# EAGLE design chain (EAGLE 6.5.0)
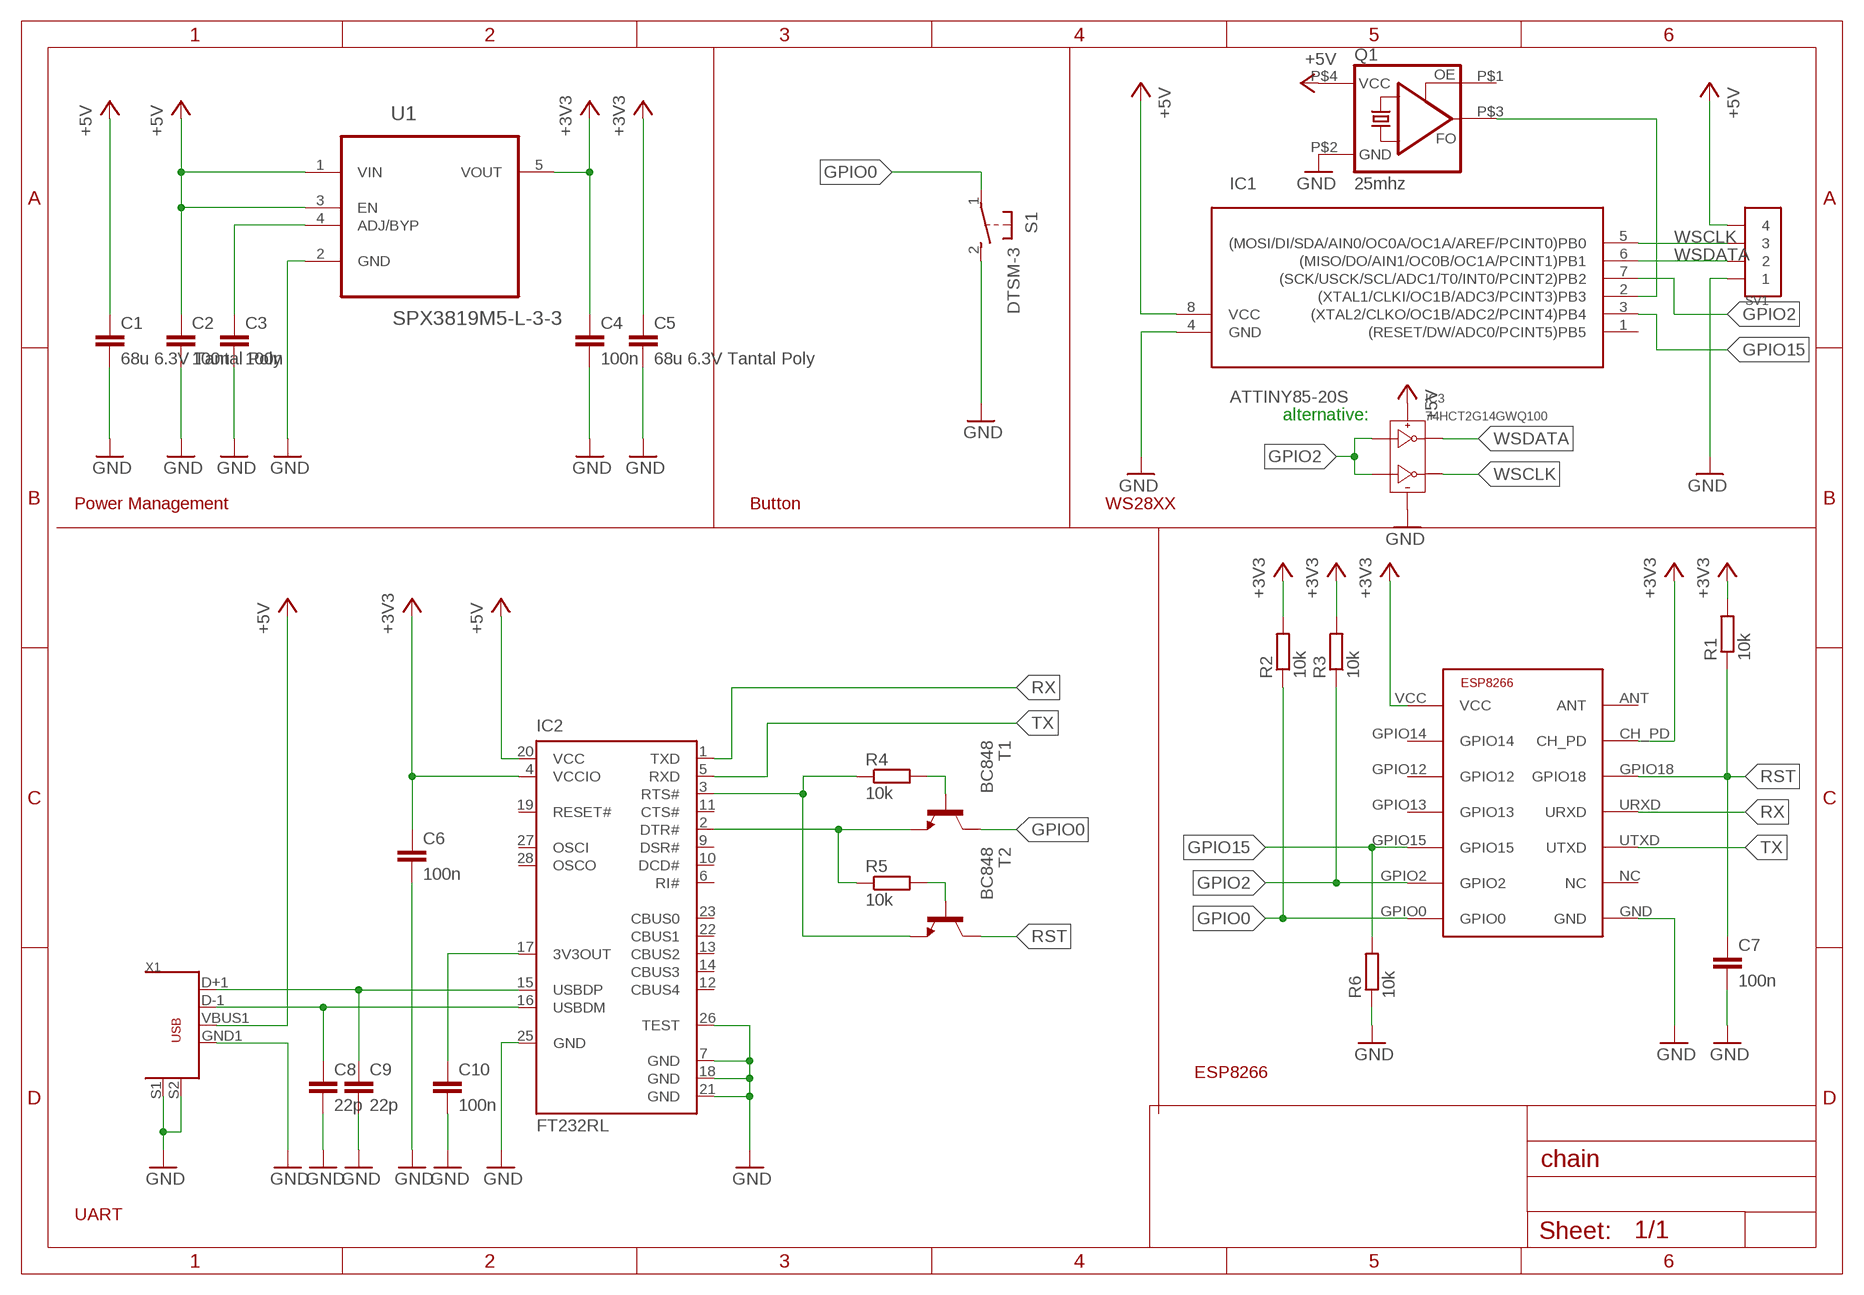
[diagram p0: schematic, sheet 1]

## Parts
C1  68u 6.3V Tantal Poly  C-EUC0805  [C0805]
C2  100n  C-EUC0603  [C0603]
C3  100n  C-EUC0603  [C0603]
C4  100n  C-EUC0603  [C0603]
C5  68u 6.3V Tantal Poly  C-EUC0805  [C0805]
C6  100n  C-EUC0603  [C0603]
C7  100n  C-EUC0603  [C0603]
C8  22p  C-EUC0603  [C0603]
C9  22p  C-EUC0603  [C0603]
C10  100n  C-EUC0603  [C0603]
IC1  ATTINY85-20S  [SOIC8]
IC2  FT232RL  [SSOP28]
IC3  74HCT2G14GWQ100  74HCT2G14  [SOT363]
Q1  25mhz  KC5032A  [KC5032A]
R1  10k  R-EU_R0603  [R0603]
R2  10k  R-EU_R0603  [R0603]
R3  10k  R-EU_R0603  [R0603]
R4  10k  R-EU_R0603  [R0603]
R5  10k  R-EU_R0603  [R0603]
R6  10k  R-EU_R0603  [R0603]
S1  DTSM-3  [DTSM-3]
SV1  1X4SMD-2.54LIEGEND  [1X4SMD-2.54LIEGEND]
T1  BC848  [SOT23]
T2  BC848  [SOT23]
U1  SPX3819M5-L-3-3  [SOT95P280X145-5N]
U$2  ESP8266  [ESP-03]
X1  USB-MALE-SMT  [USB-MALE-SMT]

## Nets
+3V3: C4.1 C5.1 C6.1 IC2.4(VCCIO) R1.2 R2.2 R3.2 U1.5(VOUT) U$2.CH_PD U$2.VCC
+5V [pwr]: C1.1 C2.1 IC1.8(VCC) IC2.20(VCC) IC3.5(VCC) Q1.P$4(VCC) SV1.P$4 U1.1(VIN) U1.3(EN) X1.VBUS1(VBUS)
GND [pwr]: C1.2 C2.2 C3.2 C4.2 C5.2 C6.2 C7.2 C8.2 C9.2 C10.2 IC1.4(GND) IC2.7(GND) IC2.18(GND) IC2.21(GND) IC2.25(GND) IC2.26(TEST) IC3.2(GND) Q1.P$2(GND) R6.1 S1.2 SV1.P$1 U1.2(GND) U$2.GND X1.GND1(GND) X1.S1 X1.S2
GPIO0: R2.1 S1.1 T1.3(C) U$2.GPIO0
GPIO2: IC1.7((SCK/USCK/SCL/ADC1/T0/INT0/PCINT2)PB2) IC3.1(1A) IC3.3(2A) R3.1 U$2.GPIO2
GPIO15: IC1.3((XTAL2/CLKO/OC1B/ADC2/PCINT4)PB4) R6.2 U$2.GPIO15
N$1: IC2.3(RTS#) R4.1 T2.2(E)
N$2: IC1.2((XTAL1/CLKI/OC1B/ADC3/PCINT3)PB3) Q1.P$3(FO)
N$3: C9.1 IC2.15(USBDP) X1.D+1(D+)
N$4: C8.1 IC2.16(USBDM) X1.D-1(D-)
N$5: IC2.2(DTR#) R5.1 T1.2(E)
N$7: R4.2 T1.1(B)
N$8: R5.2 T2.1(B)
N$15: C10.1 IC2.17(3V3OUT)
N$17: C3.1 U1.4(ADJ/BYP)
RST: C7.1 R1.1 T2.3(C) U$2.GPIO18
RX: IC2.1(TXD) U$2.URXD
TX: IC2.5(RXD) U$2.UTXD
WSCLK: IC1.5((MOSI/DI/SDA/AIN0/OC0A/OC1A/AREF/PCINT0)PB0) IC3.4(2Y) SV1.P$3
WSDATA: IC1.6((MISO/DO/AIN1/OC0B/OC1A/PCINT1)PB1) IC3.6(1Y) SV1.P$2
Unconnected: IC1.1((RESET/DW/ADC0/PCINT5)PB5) IC2.6(RI#) IC2.9(DSR#) IC2.10(DCD#) IC2.11(CTS#) IC2.12(CBUS4) IC2.13(CBUS2) IC2.14(CBUS3) IC2.19(RESET#) IC2.22(CBUS1) IC2.23(CBUS0) IC2.27(OSCI) IC2.28(OSCO) Q1.P$1(OE) U$2.ANT U$2.GPIO12 U$2.GPIO13 U$2.GPIO14 U$2.NC

## Notes on the sheet
- alternative:
- Power Management | Button | WS28XX
- ESP8266
- UART

## Library data of the parts
C1 C5 = rcl-2:C-EU: CAPACITOR, European symbol
C2-C4 C6-C10 = rcl:C-EU: CAPACITOR, European symbol
IC1 = avr:ATTINY85: MICROCONTROLLER 8 Kbytes FLASH 512 bytes EEPROM 512 bytes RAM 4-channel 10 bit ADC USI
IC2 = ftdichip:FT232R: Source: http://www.ftdichip.com/Documents/DataSheets/DS_FT232R_v104.pdf
IC3 = sid:74HCT2G14
Q1 = sid:KC5032A
R1-R6 = rcl-2:R-EU_: RESISTOR, European symbol
S1 = switch-tact:DTSM-3
SV1 = sid:1X4SMD-2.54LIEGEND
T1 T2 = transistor-neu-to92:BC848: NPN TRANSISTOR
U1 = ESP8266-2:SPX3819M5-L-3-3: 500mA, LOW-NOISE LDO VOLTAGE REGULATOR; MPN: SPX3819M5-L-3-3; OC_FARNELL: 1831949; OC_NEWARK: 23R9702; PACKAGE: SOT-23-5; SUPPLIER: EXAR
U$2 = ESP8266:ESP8266: low cost Wifi to Serial Module
X1 = sid:USB-MALE-SMT

## Net classes
0 default: width 0.152 mm, drill 0.305 mm, clearance 0.152 mm
1 pwr: width 0.152 mm, drill 0.305 mm, clearance 0.152 mm

## Board
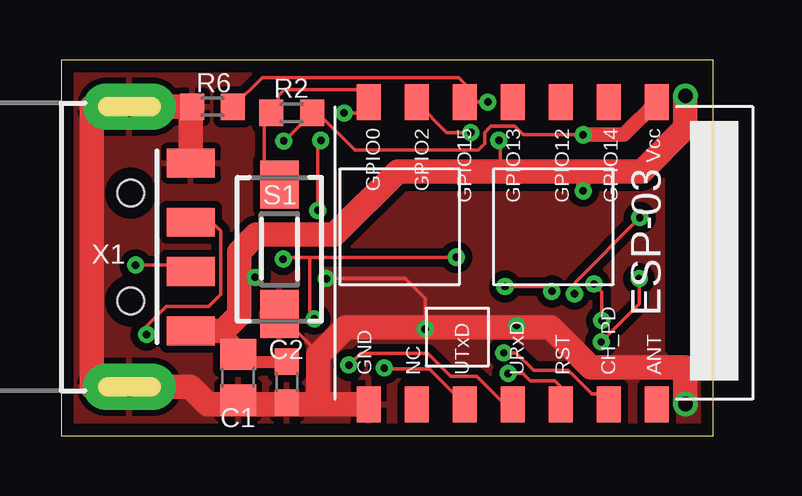
[diagram p1: board, top side]
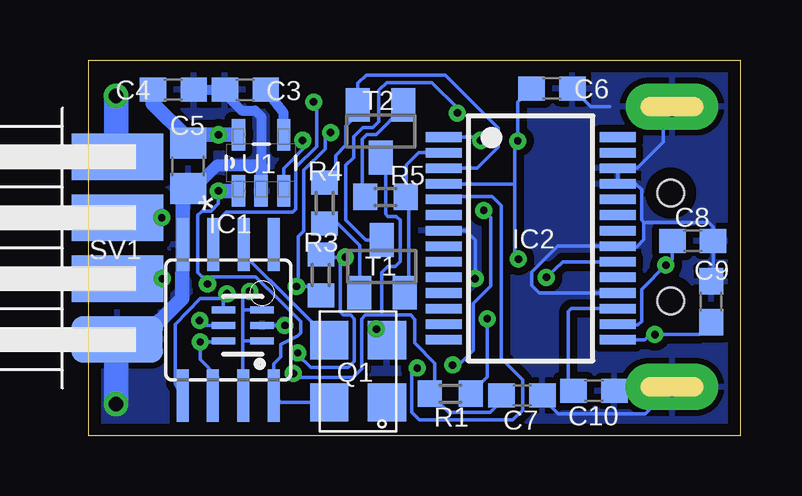
[diagram p2: board, bottom side, seen from below]

Size 27.16 x 15.67 mm. Coordinates in mm from the lower left corner, seen from the top.
Outline: 0,0 27.16,0 27.16,15.67 0,15.67 0,0
Copper layers (1*16): Top 0.035mm / dielectric 1.5mm / Bottom 0.035mm
Design rules "default *": minimum track width 6mil, minimum drill 12mil, track to track 6mil, track to pad 6mil, pad to pad 6mil, via to via 6mil, smd to smd 6mil, copper to edge 20mil, drill to drill 8mil, minimum pad ring 10mil, minimum via ring 8mil, stop-mask expansion 4mil, vias tented up to drill 26mil, thermal gap 10mil
tRestrict: area 25.6,3.7 to 26.6,12.1

### Footprints (pad centres in the part's own frame; a part is rotated, then mirrored left to right if it is on the bottom)
C0805 = smd 1.3 x 1.5: 1 -0.95,0; 2 0.95,0
C0603 = smd 1.1 x 1: 1 -0.85,0; 2 0.85,0
SOIC8 = smd 0.5 x 2.2: 1 -1.905,-3.154; 2 -0.645,-3.154; 3 0.625,-3.154; 4 1.895,-3.154; 5 1.905,3.154; 6 0.635,3.154; 7 -0.635,3.154; 8 -1.905,3.154
SSOP28 = smd 0.4 x 1.5: 1 -4.225,-3.625; 2 -3.575,-3.625; 3 -2.925,-3.625; 4 -2.275,-3.625; 5 -1.625,-3.625; 6 -0.975,-3.625; 7 -0.325,-3.625; 8 0.325,-3.625; 9 0.975,-3.625; 10 1.625,-3.625; 11 2.275,-3.625; 12 2.925,-3.625; 13 3.575,-3.625; 14 4.225,-3.625; 15 4.225,3.625; 16 3.575,3.625; 17 2.925,3.625; 18 2.275,3.625; 19 1.625,3.625; 20 0.975,3.625; 21 0.325,3.625; 22 -0.325,3.625; 23 -0.975,3.625; 24 -1.625,3.625; 25 -2.275,3.625; 26 -2.925,3.625; 27 -3.575,3.625; 28 -4.225,3.625
SOT363 = smd 0.3 x 0.99: 1 -0.65,-0.8; 2 0,-0.8; 3 0.65,-0.8; 4 0.65,0.81; 5 0,0.81; 6 -0.65,0.81
KC5032A = smd 1.6 x 1.6: P$1 -1.3,-1.2; P$2 1.3,-1.2; P$3 1.3,1.2; P$4 -1.3,1.2
R0603 = smd 1 x 1.1: 1 -0.85,0; 2 0.85,0
DTSM-3 = smd 2 x 1.6: 1 -2.7,0; 2 2.7,0
1X4SMD-2.54LIEGEND = smd 1.93 x 3.81: P$1 -5.08,0; P$2 -2.54,0; P$3 0,0; P$4 2.54,0
SOT23 = smd 1 x 1.4: 1 -0.95,-1.1; 2 0.95,-1.1; 3 0,1.1
SOT95P280X145-5N = smd 1.321 x 0.559: 1 -1.168,0.94; 2 -1.168,0; 3 -1.168,-0.94; 4 1.168,-0.94; 5 1.168,0.94
ESP-03 = smd 1 x 1.5: ANT 4,12.4; CH_PD 6,12.4; GND 16,12.4; GPIO0 16,-0.2; GPIO2 14,-0.2; GPIO12 8,-0.2; GPIO13 10,-0.2; GPIO14 6,-0.2; GPIO15 12,-0.2; GPIO18 8,12.4; NC 14,12.4; URXD 10,12.4; UTXD 12,12.4; VCC 4,-0.2
USB-MALE-SMT = smd 1.2 x 2: D+1 1.027,-6.21; D-1 -1.027,-6.21; GND1 3.5,-6.21; VBUS1 -3.5,-6.21 | drill 0.813 pad 1.93 long: S1 -5.842,-3.658; S2 5.842,-3.658 | hole 1.1: 2.25,-3.71; -2.25,-3.71

### Placement (x,y rotation side)
C1  7.37,2.44 270 top
C2  9.4,2.24 270 top
C3  20.62,14.43 180 bottom
C4  23.62,14.43 0 bottom
C5  23.01,11.25 270 bottom
C6  7.85,14.48 0 bottom
C7  9.09,1.68 0 bottom
C8  1.98,8.13 0 bottom
C9  1.22,5.59 90 bottom
C10  6.1,1.88 0 bottom
IC1  21.34,4.83 180 bottom
IC2  8.74,8.23 270 bottom
IC3  20.73,4.6 90 bottom
Q1  15.93,2.69 90 bottom
R1  12.09,1.75 0 bottom
R2  9.6,13.46 0 top
R3  17.48,6.71 90 bottom
R4  17.32,9.7 270 bottom
R5  14.78,9.96 180 bottom
R6  6.3,13.72 0 top
S1  9.09,7.77 270 top
SV1  25.96,9.09 90 bottom
T1  14.94,7.06 0 bottom
T2  14.99,12.7 180 bottom
U1  19.96,11.38 90 bottom
U$2  28.8,13.72 180 top
X1  -0.81,7.87 90 top

### Tracks (layer width: path | path; a pad name or v marks a point on that pad's centre or on a via)
+3V3  (via drill 0.3, 0.3 pad 0.3)
  Top 0.152: v21.74,12.55 19.25,12.55 18.9,12.9 17.91,12.9 17.65,12.65 17.65,12.19 17.37,11.91 12.25,11.91 10.69,13.46 R2.2 9.41,12.42 v9.27,12.29 | v16.46,7.44 10.36,7.44 | 10.36,7.44 9.32,7.44 v9.25,7.37 | v18.44,3.45 18.95,3.45 19.68,2.72 21.13,2.72 22.1,1.75 22.39,1.75 U$2.CH_PD | v10.54,4.88 10.36,5.05 10.36,7.44
  Top 0.61: U$2.VCC 23.44,12.55 v21.74,12.55
  Bottom 0.152: R3.2 17.36,7.44 v16.46,7.44 16.66,7.24 16.66,5.16 16.54,5.03 16.23,5.03 16.08,4.88 16.08,3.1 16.33,2.84 17.91,2.84 18.44,3.38 v18.44,3.45 | v9.25,7.37 9.4,7.52 9.4,10.49 | R1.2 10.54,2.45 v10.54,4.88 | 9.4,10.49 9.4,12.17 v9.27,12.29 9.27,13.91 C6.1 | IC2.4 9.41,10.51 9.4,10.49
  Bottom 0.61: U1.5 v21.74,12.55 22.54,12.55 C5.1 23.06,12.45 24.47,13.85 C4.1
+5V  (via drill 0.3, 0.61)
  Top 0.152: v18.24,12.32 18.29,12.32 18.29,11.02 | v8.08,6.6 7.42,6.6 | v22.2,6.33 22.53,5.99 v22.53,4.8
  Top 0.508: 21.74,10.97 21.79,11.02 | 6.76,4.37 7.37,3.77 C1.1 7.67,3.09 C2.1
  Top 0.61: v21.74,10.21 21.74,10.97
  Top 1.016: X1.VBUS1 6.76,4.37 7.42,5.03 7.42,6.6 7.42,7.67 8.13,8.38 11.38,8.38 14.02,11.02 18.29,11.02 21.79,11.02 24.18,11.02 26.01,12.85 v26.01,14.17
  Bottom 0.152: IC2.20 7.41,7.26 v8.08,6.6 | Q1.P$4 19.15,1.39 IC1.8 19.43,3 19.15,3.28 19.15,3.81 18.44,4.17 18.31,4.29 18.31,4.77 19.68,6.15 19.71,6.15 20.19,6.63 22.28,6.63 | U1.3 19.02,11.15 18.16,12.01 18.16,12.32 v18.24,12.32 | v21.74,10.21 21.74,9.68 22.05,9.37 22.43,9.37 22.61,9.2 22.61,6.81 22.43,6.63 22.28,6.63 | 22.28,6.63 22.2,6.58 v22.2,6.33 | v22.53,4.8 22.33,4.6 IC3.5
  Bottom 0.61: U1.1 v21.74,10.21
  Bottom 1.016: v26.01,14.17 26.01,11.63 SV1.P$4
GND  (via drill 0.3, 0.3 pad 0.3, 0.61)
  Top 0.152: C1.2 7.37,1.32 | C2.2 9.6,1.32 | 10.46,1.32 10.62,1.47 10.16,1.47 | R6.1 5.4,13.72 | 9.09,5.28 S1.2 10.72,3.45 10.72,3.38 | 20.4,4.52 19.13,4.6 v18.97,4.6 | 11.86,4.52 11.94,4.45 v15.16,4.45 15.16,5.71 14.33,6.55 v11.05,6.55
  Top 1.016: X1.GND1 5.4,13.72 X1.S2 1.27,13.72 1.27,2.03 X1.S1 5.38,2.03 6.1,1.32 7.37,1.32 9.6,1.32 10.46,1.32 U$2.GND | v26.01,1.32 26.01,2.84 22.07,2.84 20.4,4.52 11.86,4.52 10.72,3.38 10.72,1.57 10.62,1.47
  Bottom 0.152: 4.01,8.89 1.32,8.89 1.13,8.7 C8.2 1.13,6.53 C9.2 | 4.01,8.89 4.01,8.18 4.32,7.87 4.94,7.87 IC2.21 7.61,7.91 8.69,6.83 8.69,6.27 8.37,5.95 IC2.18 | 4.01,8.89 4.11,8.99 4.11,10.26 4.36,10.51 IC2.25 IC2.26 4.29,11.16 3.2,12.24 3.2,13.36 X1.S2 | C10.2 2.84,1.88 X1.S1 3.96,0.91 7.58,0.91 8.24,1.58 C7.2 | IC2.7 11.45,8.55 11.05,8.15 v11.05,6.55 | IC3.2 v18.97,4.6 | Q1.P$2 15.16,4.43 v15.16,4.45 | C6.2 6.24,13.72 5.44,13.72
  Bottom 0.406: 19.96,11.28 19.96,13.31 20.22,13.56 20.78,13.56 21.47,14.26 C3.2 C4.2
  Bottom 0.508: C5.2 22.9,10.17 21.79,11.28 19.96,11.28 U1.2
  Bottom 0.61: C5.2 23.03,10.14 23.24,9.93 23.24,9.8 IC1.4 23.26,5.73 24.99,3.99 24.99,3.96 25.91,3.96 SV1.P$1
  Bottom 1.016: SV1.P$1 26.01,2.95 v26.01,1.32
  pour Top (isolate 0.305): 0.25,15.19 26.87,15.19 26.87,0.36 0.25,0.36
  pour Bottom (isolate 0.305): 0.25,15.39 26.87,15.39 26.87,0.36 0.25,0.36
GPIO0  (via drill 0.3)
  Top 0.152: v11.79,13.46 12.35,13.46 U$2.GPIO0 12.29,14.43 9.3,14.43 9.04,14.17 9.04,13.6 R2.1 8.75,13.32 8.46,13.03 8.46,11.11 S1.1
  Bottom 0.152: T1.3 15.6,8.16 16.43,8.99 16.43,11.28 16.1,11.61 16.1,12.47 15.72,12.85 15.32,12.85 15.06,13.11 15.06,14.4 14.73,14.73 12.85,14.73 11.76,13.64 11.76,13.49 v11.79,13.46
GPIO2  (via drill 0.3)
  Top 0.152: U$2.GPIO2 16.07,12.65 v17.07,12.65 | v20.45,6.02 20.24,6.22 v18.49,6.22
  Bottom 0.152: v17.07,12.65 17.3,12.42 17.3,11.96 18.19,11.07 18.19,8.53 18.41,8.31 18.41,6.3 v18.49,6.22 17.84,6.22 R3.1 | IC1.7 20.73,1.9 20.73,3.94 | 20.73,3.94 20.73,5.23 | 20.73,5.23 20.73,5.74 v20.45,6.02 | IC3.3 20.71,5.25 20.73,5.23 | IC3.1 20.72,3.95 20.73,3.94
GPIO15  (via drill 0.3)
  Top 0.152: R6.2 8.37,14.94 16.56,14.94 16.8,14.69 U$2.GPIO15 v17.78,13.92
  Bottom 0.152: IC1.3 21.76,8.98 21.41,9.32 18.64,9.32 18.52,9.45 18.52,11.2 17.65,12.06 17.65,13.77 v17.78,13.92
N$1
  Bottom 0.152: R4.1 17.32,10.54 16.87,11 16.87,11.68 16.43,12.12 16.43,12.9 15.96,13.38 T2.2 15.94,14.7 15.6,15.04 12.29,15.04 10.08,12.83 10.08,12.04 10.97,11.16 IC2.3
N$2
  Bottom 0.152: Q1.P$3 17.81,3.99 17.81,4.7 19.58,6.48 19.61,6.48 20.69,7.56 IC1.2
N$3  (via drill 0.3)
  Top 0.152: X1.D+1 6.29,8.9 6.65,8.53 6.65,5.89 6.15,5.38 4.37,5.38 3.56,4.57 v3.56,4.22
  Bottom 0.152: C9.1 1.74,4.22 v3.56,4.22 3.76,4.22 3.97,4.01 IC2.15
N$4  (via drill 0.3)
  Top 0.152: v3.1,7.11 5.13,7.11 X1.D-1
  Bottom 0.152: C8.1 2.83,7.38 v3.1,7.11 4.11,6.1 4.11,4.77 4.27,4.62 4.93,4.62 IC2.16
N$5
  Bottom 0.152: IC2.2 13.39,11.8 13.92,11.28 13.92,9.87 R5.1 13.82,9.96 13.82,5.99 13.83,5.96 T1.2
N$7
  Bottom 0.152: T1.1 15.85,5.99 15.85,7.92 16.78,8.85 R4.2
N$8
  Bottom 0.152: T2.1 14.04,13.7 15.16,12.55 15.57,12.55 15.75,12.37 15.75,10.05 R5.2
N$15
  Bottom 0.152: IC2.17 7.05,5.3 7.16,5.19 | 7.16,5.19 7.16,1.89 C10.1 | 7.17,5.18 7.16,5.19
N$17
  Bottom 0.406: U1.4 19.02,13.47 C3.1
RST  (via drill 0.3)
  Top 0.152: U$2.GPIO18 20.8,2.06 20.57,2.29 19.53,2.29 19.23,2.59 v18.62,2.59
  Bottom 0.152: T2.3 14.78,11.35 14.78,9.25 14.68,9.14 14.33,9.14 14.17,8.99 14.17,7.26 14.38,7.06 14.68,7.06 14.94,6.81 14.94,5.03 | 14.94,5.03 13.74,5.03 13.56,4.85 13.56,3.86 12.73,3.02 12.73,1.97 R1.1 12.15,0.96 10.41,0.96 9.94,1.44 C7.1 | 14.94,5.03 15.62,5.03 15.77,4.88 15.77,2.79 16.13,2.44 18.47,2.44 v18.62,2.59
RX  (via drill 0.3)
  Top 0.152: 18.77,1.32 U$2.URXD 18.47,1.32 17.32,2.46 16.23,2.46 15.27,3.43 12.47,3.43 v11.99,2.95 | v10.69,9.4 10.69,12.19 v10.82,12.32
  Bottom 0.152: v10.69,9.4 10.39,9.09 10.39,6.25 11.13,5.51 11.13,3.56 11.73,2.95 v11.99,2.95 | v10.82,12.32 10.96,12.45 IC2.1
TX  (via drill 0.3)
  Top 0.152: U$2.UTXD 15.33,2.79 13.67,2.79 13.49,2.79 v13.46,2.82
  Bottom 0.152: v13.46,2.82 13.69,2.59 13.69,0.96 13.39,0.66 9.47,0.66 9.07,1.07 9.07,2.34 9.96,3.23 9.96,9.6 10.34,9.98 11.76,9.98 11.84,9.85 IC2.5
WSCLK  (via drill 0.3, 0.3 pad 0.3)
  Top 0.152: v24.1,9.09 21.41,6.4 v21.39,5.92
  Bottom 0.152: v24.1,9.09 SV1.P$3 | IC3.4 21.54,5.79 v21.39,5.92 21.62,5.71 22.5,5.71 23.55,4.65 23.55,2.18 IC1.5
WSDATA  (via drill 0.3)
  Top 0.152: v22.5,3.91 24.08,5.49 v24.08,6.55
  Bottom 0.152: v24.08,6.55 SV1.P$2 | IC1.6 21.77,2.44 22.5,3.17 v22.5,3.91 21.57,3.91 IC3.6

### Text on the board
Document: + | v1.0 | -